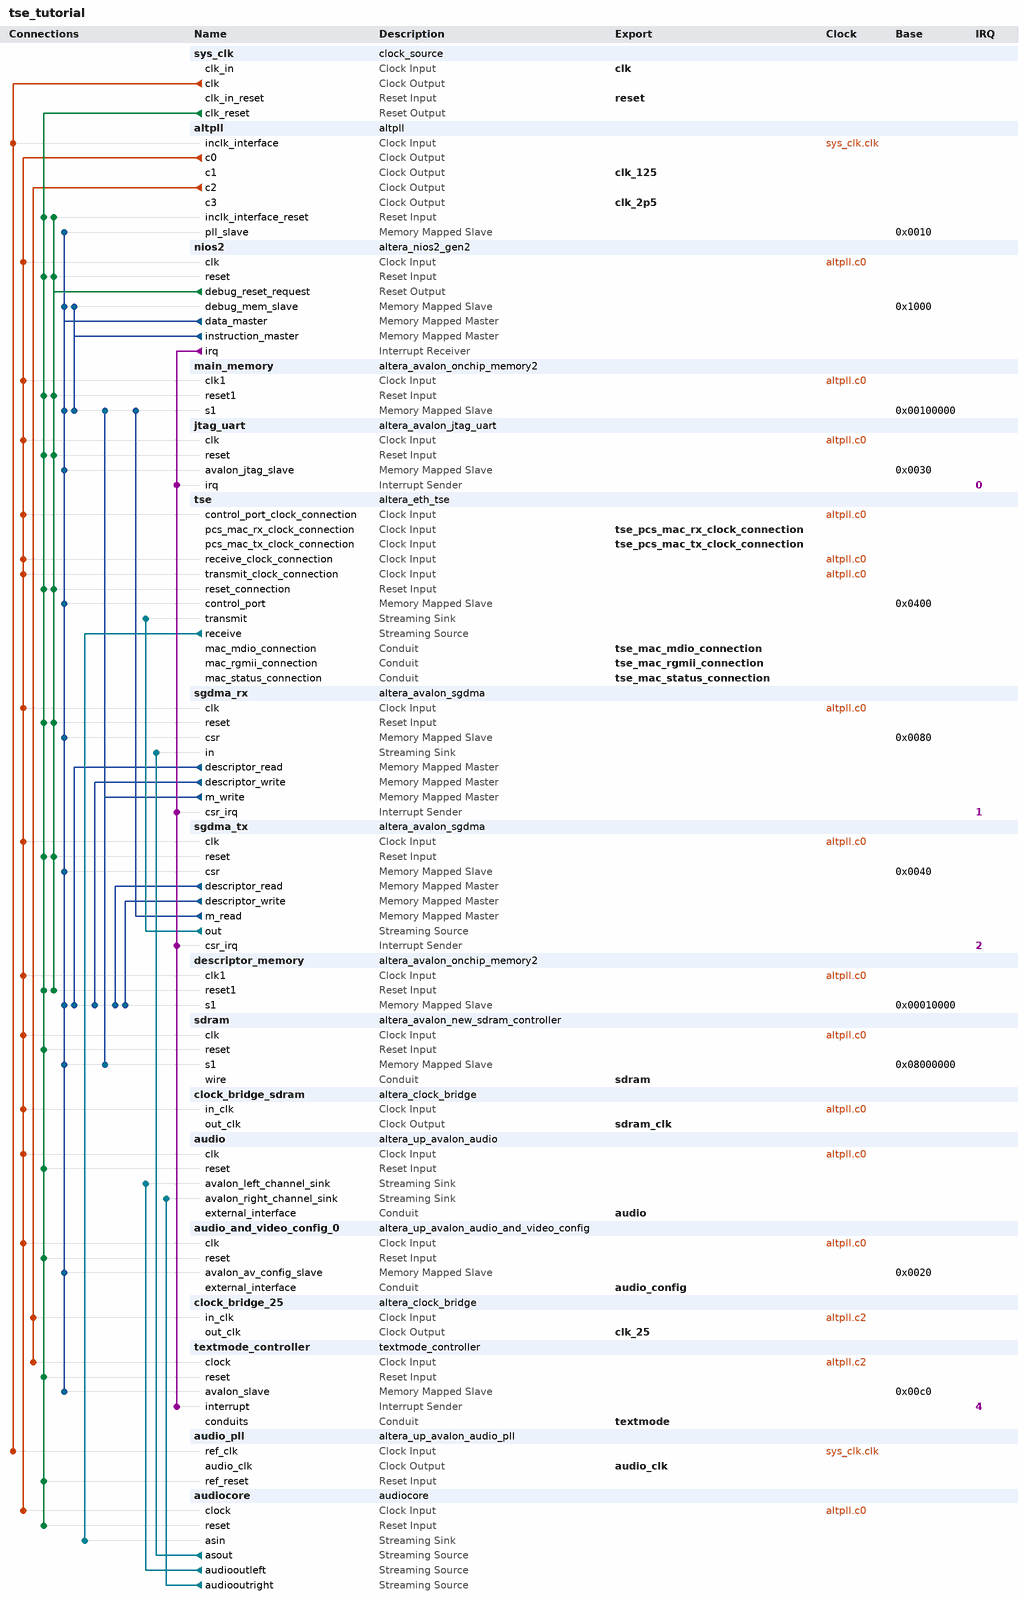
[diagram p0: system contents]
# Platform Designer (Qsys) system tse_tutorial, Cyclone IV E EP4CE115F29C7
# Parameters at their usual value, and those the tool derives, are not listed.
package require -exact qsys 15.0
create_system tse_tutorial
set_project_property DEVICE_FAMILY {Cyclone IV E}
set_project_property DEVICE EP4CE115F29C7

add_instance sys_clk clock_source 15.0
set_instance_parameter_value sys_clk clockFrequency 50000000

add_instance altpll altpll 15.0
set_instance_parameter_value altpll CLK0_DIVIDE_BY 1
set_instance_parameter_value altpll CLK0_MULTIPLY_BY 1
set_instance_parameter_value altpll CLK1_DIVIDE_BY 2
set_instance_parameter_value altpll CLK1_DUTY_CYCLE 50
set_instance_parameter_value altpll CLK1_MULTIPLY_BY 5
set_instance_parameter_value altpll CLK1_PHASE_SHIFT 0
set_instance_parameter_value altpll CLK2_DIVIDE_BY 2
set_instance_parameter_value altpll CLK2_DUTY_CYCLE 50
set_instance_parameter_value altpll CLK2_MULTIPLY_BY 1
set_instance_parameter_value altpll CLK2_PHASE_SHIFT 0
set_instance_parameter_value altpll CLK3_DIVIDE_BY 20
set_instance_parameter_value altpll CLK3_DUTY_CYCLE 50
set_instance_parameter_value altpll CLK3_MULTIPLY_BY 1
set_instance_parameter_value altpll CLK3_PHASE_SHIFT 0
set_instance_parameter_value altpll INCLK0_INPUT_FREQUENCY 20000
set_instance_parameter_value altpll PORT_ARESET PORT_UNUSED
set_instance_parameter_value altpll PORT_LOCKED PORT_UNUSED
set_instance_parameter_value altpll PORT_clk1 PORT_USED
set_instance_parameter_value altpll PORT_clk2 PORT_USED
set_instance_parameter_value altpll PORT_clk3 PORT_USED

add_instance nios2 altera_nios2_gen2 15.0
set_instance_parameter_value nios2 dcache_size 0
set_instance_parameter_value nios2 exceptionSlave main_memory.s1
set_instance_parameter_value nios2 icache_size 1024
set_instance_parameter_value nios2 impl Fast
set_instance_parameter_value nios2 resetSlave main_memory.s1
set_instance_parameter_value nios2 resetrequest_enabled false

add_instance main_memory altera_avalon_onchip_memory2 15.0
set_instance_parameter_value main_memory dataWidth 32
set_instance_parameter_value main_memory dualPort false
set_instance_parameter_value main_memory initMemContent true
set_instance_parameter_value main_memory initializationFileName onchip_mem.hex
set_instance_parameter_value main_memory memorySize 307200

add_instance jtag_uart altera_avalon_jtag_uart 15.0
set_instance_parameter_value jtag_uart simInteractiveOptions NO_INTERACTIVE_WINDOWS

add_instance tse altera_eth_tse 15.0
set_instance_parameter_value tse core_variation MAC_ONLY
set_instance_parameter_value tse eg_addr 6
set_instance_parameter_value tse enable_hd_logic true
set_instance_parameter_value tse enable_mac_flow_ctrl false
set_instance_parameter_value tse enable_magic_detect false
set_instance_parameter_value tse enable_shift16 true
set_instance_parameter_value tse ifGMII RGMII
set_instance_parameter_value tse ing_addr 6
set_instance_parameter_value tse mdio_clk_div 40
set_instance_parameter_value tse stat_cnt_ena true
set_instance_parameter_value tse transceiver_type NONE

add_instance sgdma_rx altera_avalon_sgdma 15.0
set_instance_parameter_value sgdma_rx enableBurstTransfers false
set_instance_parameter_value sgdma_rx enableUnalignedTransfers false
set_instance_parameter_value sgdma_rx readBlockDataWidth 32
set_instance_parameter_value sgdma_rx sinkErrorWidth 6
set_instance_parameter_value sgdma_rx sourceErrorWidth 0
set_instance_parameter_value sgdma_rx transferMode STREAM_TO_MEMORY
set_instance_parameter_value sgdma_rx writeBurstcountWidth 4

add_instance sgdma_tx altera_avalon_sgdma 15.0
set_instance_parameter_value sgdma_tx enableBurstTransfers false
set_instance_parameter_value sgdma_tx enableUnalignedTransfers false
set_instance_parameter_value sgdma_tx readBlockDataWidth 32
set_instance_parameter_value sgdma_tx sinkErrorWidth 0
set_instance_parameter_value sgdma_tx sourceErrorWidth 1
set_instance_parameter_value sgdma_tx transferMode MEMORY_TO_STREAM
set_instance_parameter_value sgdma_tx writeBurstcountWidth 4

add_instance descriptor_memory altera_avalon_onchip_memory2 15.0
set_instance_parameter_value descriptor_memory dataWidth 32
set_instance_parameter_value descriptor_memory dualPort false
set_instance_parameter_value descriptor_memory initMemContent true
set_instance_parameter_value descriptor_memory initializationFileName onchip_mem.hex
set_instance_parameter_value descriptor_memory memorySize 32800

add_instance sdram altera_avalon_new_sdram_controller 15.0
set_instance_parameter_value sdram TAC 5.5
set_instance_parameter_value sdram TRCD 20.0
set_instance_parameter_value sdram TRP 20.0
set_instance_parameter_value sdram casLatency 3
set_instance_parameter_value sdram columnWidth 10
set_instance_parameter_value sdram dataWidth 32
set_instance_parameter_value sdram generateSimulationModel true
set_instance_parameter_value sdram model single_Micron_MT48LC4M32B2_7_chip
set_instance_parameter_value sdram numberOfBanks 4
set_instance_parameter_value sdram numberOfChipSelects 1
set_instance_parameter_value sdram powerUpDelay 100.0
set_instance_parameter_value sdram refreshPeriod 15.625
set_instance_parameter_value sdram rowWidth 13

add_instance clock_bridge_sdram altera_clock_bridge 15.0
set_instance_parameter_value clock_bridge_sdram DERIVED_CLOCK_RATE 50000000
set_instance_parameter_value clock_bridge_sdram EXPLICIT_CLOCK_RATE 0

add_instance audio altera_up_avalon_audio 15.0
set_instance_parameter_value audio audio_in false
set_instance_parameter_value audio avalon_bus_type Streaming
set_instance_parameter_value audio dw 32

add_instance audio_and_video_config_0 altera_up_avalon_audio_and_video_config 15.0
set_instance_parameter_value audio_and_video_config_0 audio_in {Line In to ADC}
set_instance_parameter_value audio_and_video_config_0 bit_length 32
set_instance_parameter_value audio_and_video_config_0 board DE2-115
set_instance_parameter_value audio_and_video_config_0 line_in_bypass false
set_instance_parameter_value audio_and_video_config_0 sampling_rate {32 kHz}

add_instance clock_bridge_25 altera_clock_bridge 15.0
set_instance_parameter_value clock_bridge_25 DERIVED_CLOCK_RATE 25000000
set_instance_parameter_value clock_bridge_25 EXPLICIT_CLOCK_RATE 0

add_instance textmode_controller textmode_controller 1.0
set_instance_parameter_value textmode_controller CLK_FREQ 25000000
set_instance_parameter_value textmode_controller COLUM_COUNT 100
set_instance_parameter_value textmode_controller DATA_WIDTH 32
set_instance_parameter_value textmode_controller ROW_COUNT 30

add_instance audio_pll altera_up_avalon_audio_pll 15.0
set_instance_parameter_value audio_pll gui_refclk 50.0

add_instance audiocore audiocore 1.0

# connections
add_connection altpll.c0 audio.clk clock
add_connection altpll.c0 audio_and_video_config_0.clk clock
add_connection altpll.c0 audiocore.clock clock
add_connection altpll.c0 clock_bridge_sdram.in_clk clock
add_connection altpll.c0 descriptor_memory.clk1 clock
add_connection altpll.c0 jtag_uart.clk clock
add_connection altpll.c0 main_memory.clk1 clock
add_connection altpll.c0 nios2.clk clock
add_connection altpll.c0 sdram.clk clock
add_connection altpll.c0 sgdma_rx.clk clock
add_connection altpll.c0 sgdma_tx.clk clock
add_connection altpll.c0 tse.control_port_clock_connection clock
add_connection altpll.c0 tse.receive_clock_connection clock
add_connection altpll.c0 tse.transmit_clock_connection clock
add_connection altpll.c2 clock_bridge_25.in_clk clock
add_connection altpll.c2 textmode_controller.clock clock
add_connection sys_clk.clk altpll.inclk_interface clock
add_connection sys_clk.clk audio_pll.ref_clk clock
add_connection nios2.debug_reset_request altpll.inclk_interface_reset reset
add_connection nios2.debug_reset_request descriptor_memory.reset1 reset
add_connection nios2.debug_reset_request jtag_uart.reset reset
add_connection nios2.debug_reset_request main_memory.reset1 reset
add_connection nios2.debug_reset_request nios2.reset reset
add_connection nios2.debug_reset_request sgdma_rx.reset reset
add_connection nios2.debug_reset_request sgdma_tx.reset reset
add_connection nios2.debug_reset_request tse.reset_connection reset
add_connection sys_clk.clk_reset altpll.inclk_interface_reset reset
add_connection sys_clk.clk_reset audio.reset reset
add_connection sys_clk.clk_reset audio_and_video_config_0.reset reset
add_connection sys_clk.clk_reset audio_pll.ref_reset reset
add_connection sys_clk.clk_reset audiocore.reset reset
add_connection sys_clk.clk_reset descriptor_memory.reset1 reset
add_connection sys_clk.clk_reset jtag_uart.reset reset
add_connection sys_clk.clk_reset main_memory.reset1 reset
add_connection sys_clk.clk_reset nios2.reset reset
add_connection sys_clk.clk_reset sdram.reset reset
add_connection sys_clk.clk_reset sgdma_rx.reset reset
add_connection sys_clk.clk_reset sgdma_tx.reset reset
add_connection sys_clk.clk_reset textmode_controller.reset reset
add_connection sys_clk.clk_reset tse.reset_connection reset
add_connection nios2.data_master altpll.pll_slave avalon
set_connection_parameter_value nios2.data_master/altpll.pll_slave baseAddress 0x0010
add_connection nios2.data_master audio_and_video_config_0.avalon_av_config_slave avalon
set_connection_parameter_value nios2.data_master/audio_and_video_config_0.avalon_av_config_slave baseAddress 0x0020
add_connection nios2.data_master descriptor_memory.s1 avalon
set_connection_parameter_value nios2.data_master/descriptor_memory.s1 baseAddress 0x00010000
add_connection nios2.data_master jtag_uart.avalon_jtag_slave avalon
set_connection_parameter_value nios2.data_master/jtag_uart.avalon_jtag_slave baseAddress 0x0030
add_connection nios2.data_master main_memory.s1 avalon
set_connection_parameter_value nios2.data_master/main_memory.s1 baseAddress 0x00100000
add_connection nios2.data_master nios2.debug_mem_slave avalon
set_connection_parameter_value nios2.data_master/nios2.debug_mem_slave baseAddress 0x1000
add_connection nios2.data_master sdram.s1 avalon
set_connection_parameter_value nios2.data_master/sdram.s1 baseAddress 0x08000000
add_connection nios2.data_master sgdma_rx.csr avalon
set_connection_parameter_value nios2.data_master/sgdma_rx.csr baseAddress 0x0080
add_connection nios2.data_master sgdma_tx.csr avalon
set_connection_parameter_value nios2.data_master/sgdma_tx.csr baseAddress 0x0040
add_connection nios2.data_master textmode_controller.avalon_slave avalon
set_connection_parameter_value nios2.data_master/textmode_controller.avalon_slave baseAddress 0x00c0
add_connection nios2.data_master tse.control_port avalon
set_connection_parameter_value nios2.data_master/tse.control_port baseAddress 0x0400
add_connection nios2.instruction_master main_memory.s1 avalon
set_connection_parameter_value nios2.instruction_master/main_memory.s1 baseAddress 0x00100000
add_connection nios2.instruction_master nios2.debug_mem_slave avalon
set_connection_parameter_value nios2.instruction_master/nios2.debug_mem_slave baseAddress 0x1000
add_connection sgdma_rx.descriptor_read descriptor_memory.s1 avalon
set_connection_parameter_value sgdma_rx.descriptor_read/descriptor_memory.s1 baseAddress 0x00010000
add_connection sgdma_rx.descriptor_write descriptor_memory.s1 avalon
set_connection_parameter_value sgdma_rx.descriptor_write/descriptor_memory.s1 baseAddress 0x00010000
add_connection sgdma_rx.m_write main_memory.s1 avalon
set_connection_parameter_value sgdma_rx.m_write/main_memory.s1 baseAddress 0x00100000
add_connection sgdma_rx.m_write sdram.s1 avalon
set_connection_parameter_value sgdma_rx.m_write/sdram.s1 baseAddress 0x08000000
add_connection sgdma_tx.descriptor_read descriptor_memory.s1 avalon
set_connection_parameter_value sgdma_tx.descriptor_read/descriptor_memory.s1 baseAddress 0x00010000
add_connection sgdma_tx.descriptor_write descriptor_memory.s1 avalon
set_connection_parameter_value sgdma_tx.descriptor_write/descriptor_memory.s1 baseAddress 0x00010000
add_connection sgdma_tx.m_read main_memory.s1 avalon
set_connection_parameter_value sgdma_tx.m_read/main_memory.s1 baseAddress 0x00100000
add_connection audiocore.asout sgdma_rx.in avalon_streaming
add_connection audiocore.audiooutleft audio.avalon_left_channel_sink avalon_streaming
add_connection audiocore.audiooutright audio.avalon_right_channel_sink avalon_streaming
add_connection sgdma_tx.out tse.transmit avalon_streaming
add_connection tse.receive audiocore.asin avalon_streaming
add_connection nios2.irq jtag_uart.irq interrupt
set_connection_parameter_value nios2.irq/jtag_uart.irq irqNumber 0
add_connection nios2.irq sgdma_rx.csr_irq interrupt
set_connection_parameter_value nios2.irq/sgdma_rx.csr_irq irqNumber 1
add_connection nios2.irq sgdma_tx.csr_irq interrupt
set_connection_parameter_value nios2.irq/sgdma_tx.csr_irq irqNumber 2
add_connection nios2.irq textmode_controller.interrupt interrupt
set_connection_parameter_value nios2.irq/textmode_controller.interrupt irqNumber 4

# exported interfaces
add_interface audio conduit end
set_interface_property audio EXPORT_OF audio.external_interface
add_interface audio_clk clock source
set_interface_property audio_clk EXPORT_OF audio_pll.audio_clk
add_interface audio_config conduit end
set_interface_property audio_config EXPORT_OF audio_and_video_config_0.external_interface
add_interface clk clock sink
set_interface_property clk EXPORT_OF sys_clk.clk_in
add_interface clk_125 clock source
set_interface_property clk_125 EXPORT_OF altpll.c1
add_interface clk_25 clock source
set_interface_property clk_25 EXPORT_OF clock_bridge_25.out_clk
add_interface clk_2p5 clock source
set_interface_property clk_2p5 EXPORT_OF altpll.c3
add_interface reset reset sink
set_interface_property reset EXPORT_OF sys_clk.clk_in_reset
add_interface sdram conduit end
set_interface_property sdram EXPORT_OF sdram.wire
add_interface sdram_clk clock source
set_interface_property sdram_clk EXPORT_OF clock_bridge_sdram.out_clk
add_interface textmode conduit end
set_interface_property textmode EXPORT_OF textmode_controller.conduits
add_interface tse_mac_mdio_connection conduit end
set_interface_property tse_mac_mdio_connection EXPORT_OF tse.mac_mdio_connection
add_interface tse_mac_rgmii_connection conduit end
set_interface_property tse_mac_rgmii_connection EXPORT_OF tse.mac_rgmii_connection
add_interface tse_mac_status_connection conduit end
set_interface_property tse_mac_status_connection EXPORT_OF tse.mac_status_connection
add_interface tse_pcs_mac_rx_clock_connection clock sink
set_interface_property tse_pcs_mac_rx_clock_connection EXPORT_OF tse.pcs_mac_rx_clock_connection
add_interface tse_pcs_mac_tx_clock_connection clock sink
set_interface_property tse_pcs_mac_tx_clock_connection EXPORT_OF tse.pcs_mac_tx_clock_connection

set_interconnect_requirement {$system} qsys_mm.clockCrossingAdapter HANDSHAKE
set_interconnect_requirement {$system} qsys_mm.enableEccProtection FALSE
set_interconnect_requirement {$system} qsys_mm.insertDefaultSlave FALSE
set_interconnect_requirement {$system} qsys_mm.maxAdditionalLatency 1

save_system tse_tutorial.qsys
